# EAGLE schematic f28069M (EAGLE 7.7.0)
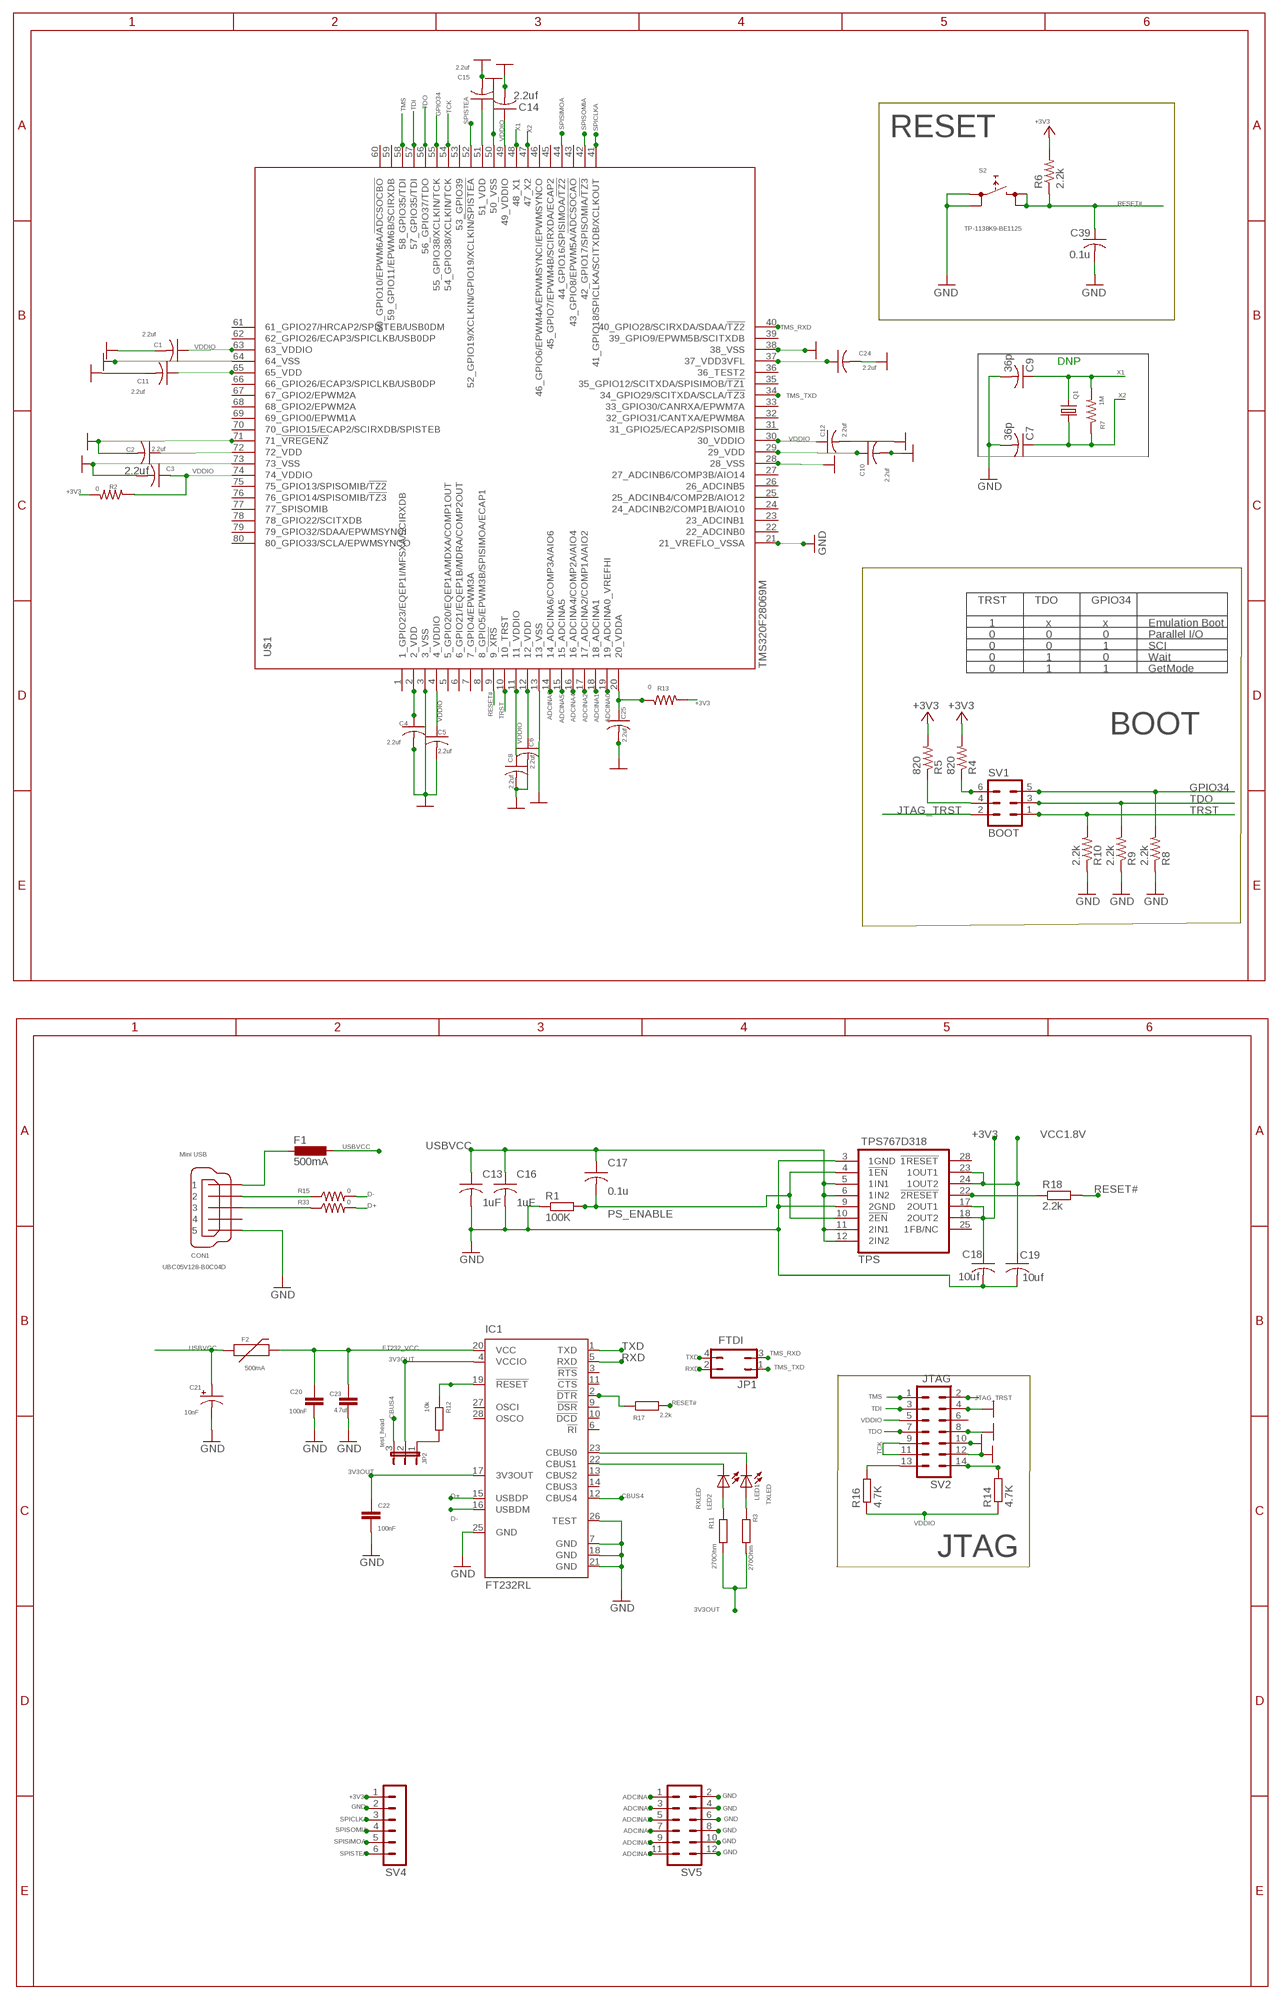
[diagram p0: schematic, sheet 1]

## Parts
C1  2.2uf  C-USC1206K  [C1206K]
C2  2.2uf  C-USC1206K  [C1206K]
C3  2.2uf  C-USC1206K  [C1206K]
C4  2.2uf  C-USC1206K  [C1206K]
C5  2.2uf  C-USC1206K  [C1206K]
C6  2.2uf  C-USC1206K  [C1206K]
C7  36p  C-USC1206K  [C1206K]
C8  2.2uf  C-USC1206K  [C1206K]
C9  36p  C-USC1206K  [C1206K]
C10  2.2uf  C-USC1206K  [C1206K]
C11  2.2uf  C-USC1206K  [C1206K]
C12  2.2uf  C-USC1206K  [C1206K]
C13  1uF  CAP-2,5  [C-2,5]
C14  2.2uf  C-USC1206K  [C1206K]
C15  2.2uf  C-USC1206K  [C1206K]
C16  1uF  CAP-2,5  [C-2,5]
C17  0.1u  CAP-2,5  [C-2,5]
C18  10uf  CAP-2,5  [C-2,5]
C19  10uf  CAP-2,5  [C-2,5]
C20  100nF  CAP1210  [1210]
C21  10nF  CAP_POL1206  [EIA3216]
C22  100nF  CAP1210  [1210]
C23  4.7uf  C2,5-3  [C2.5-3]
C24  2.2uf  C-USC1206K  [C1206K]
C25  2.2uf  C-USC1206K  [C1206K]
C39  0.1u  C-USC1206K  [C1206K]
CON1  UBC05V128-B0C04D  MINI-USB-32005-201  [32005-201]
F1  500mA  L-EUL1812  [L1812]
F2  500mA  PTCSMD  [PTC-1206]
IC1  FT232RL  [SSOP28]
JP1  FTDI  JP2Q  [JP2Q]
JP2  test_head  JP2E  [JP2]
LED1  TXLED  LEDCHIPLED_1206  [CHIPLED_1206]
LED2  RXLED  LEDCHIPLED_1206  [CHIPLED_1206]
Q1  CRYSTALHC49S  [HC49/S]
R1  100K  R-EU_M1206  [M1206]
R2  0  R-US_R1206  [R1206]
R3  270Ohm  R-EU_M1206  [M1206]
R4  820  R-US_R1206  [R1206]
R5  820  R-US_R1206  [R1206]
R6  2.2k  R-US_R1206  [R1206]
R7  1M  R-US_R1206  [R1206]
R8  2.2k  R-US_R1206  [R1206]
R9  2.2k  R-US_R1206  [R1206]
R10  2.2k  R-US_R1206  [R1206]
R11  270Ohm  R-EU_M1206  [M1206]
R12  10k  R-EU_M1206  [M1206]
R13  0  R-US_R1206  [R1206]
R14  4.7K  R-EU_M1206  [M1206]
R15  0  R-US_R1206  [R1206]
R16  4.7K  R-EU_M1206  [M1206]
R17  2.2k  R-EU_M1206  [M1206]
R18  2.2k  R-EU_M1206  [M1206]
R33  0  R-US_R1206W  [R1206W]
S2  TP-1138K9-BE1125  FSMJSMA  [FSMJSMA]
SV1  BOOT  MA03-2  [MA03-2]
SV2  JTAG  MA07-2  [MA07-2]
SV4  MA06-1  [MA06-1]
SV5  MA06-2  [MA06-2]
TPS  TPS767D318  767D3XX  [767D3XX]
U$1  TMS320F28069M  [S-PQFP-G80]

## Nets
3V3OUT: C22.1 IC1.4(VCCIO) IC1.17(3V3OUT) JP2.2 R3.2 R11.2
+3V3: C18.1 R2.2 R4.2 R5.2 R6.2 R13.2 SV4.1 TPS.17(2OUT1) TPS.18(2OUT2)
ADCINA0: SV5.1 U$1.19(19_ADCINA0_VREFHI)
ADCINA1: SV5.3 U$1.18(18_ADCINA1)
ADCINA2: SV5.5 U$1.17(17_ADCINA2/COMP1A/AIO2)
ADCINA4: SV5.7 U$1.16(16_ADCINA4/COMP2A/AIO4)
ADCINA5: SV5.9 U$1.15(15_ADCINA5)
ADCINA6: SV5.11 U$1.14(14_ADCINA6/COMP3A/AIO6)
CBUS4: IC1.12(CBUS4) JP2.3
D+: IC1.15(USBDP) R33.2
D-: IC1.16(USBDM) R15.2
FT232_VCC [power]: C20.1 C23.1 F2.2 IC1.20(VCC)
GND: C1.2 C2.2 C3.2 C4.2 C5.2 C6.2 C7.2 C8.2 C9.2 C10.2 C11.2 C12.2 C13.2 C14.2 C15.2 C16.2 C18.2 C19.2 C20.2 C21.C(-) C22.2 C23.2 C24.2 C25.2 C39.2 CON1.5 IC1.7(GND) IC1.18(GND) IC1.21(GND) IC1.25(GND) IC1.26(TEST) R1.1 R8.1 R9.1 R10.1 S2.P$1 S2.P$2 SV2.4 SV2.8 SV2.10 SV2.12 SV4.2 SV5.2 SV5.4 SV5.6 SV5.8 SV5.10 SV5.12 TPS.3(1GND) TPS.9(2GND) U$1.3(3_VSS) U$1.13(13_VSS) U$1.21(21_VREFLO_VSSA) U$1.28(28_VSS) U$1.38(38_VSS) U$1.50(50_VSS) U$1.64(64_VSS) U$1.71(71_!VREGENZ) U$1.73(73_VSS)
GPIO34: R8.2 SV1.5 U$1.55(55_GPIO38/XCLKIN/TCK)
JTAG_TRST: SV1.2 SV2.2
N$1: C10.1 U$1.29(29_VDD)
N$2: R16.2 SV2.13
N$3: C15.1 U$1.51(51_VDD)
N$4: C24.1 U$1.37(37_VDD3VFL)
N$5: R4.1 SV1.6
N$6: R5.1 SV1.4
N$7: R14.2 SV2.14
N$8: C11.1 U$1.65(65_VDD)
N$9: IC1.2(!DTR) R17.1
N$10: R18.1 TPS.22(!2RESET)
N$11: C2.1 U$1.72(72_VDD)
N$13: C4.1 U$1.2(2_VDD)
N$15: C6.1 U$1.12(12_VDD)
N$18: LED1.A R3.1
N$19: LED2.A R11.1
N$20: IC1.23(CBUS0) LED1.C
N$21: IC1.22(CBUS1) LED2.C
N$22: JP2.1 R12.2
N$38: CON1.2 R15.1
N$39: CON1.3 R33.1
PS_ENABLE: C17.2 R1.2 TPS.4(!1EN) TPS.10(!2EN)
RESET: IC1.19(!RESET) R12.1
RESET#: C39.1 R6.1 R17.2 R18.2 S2.P$3 S2.P$4 U$1.9(9_!XRS)
RXD: IC1.5(RXD) JP1.2
SPICLKA: SV4.3 U$1.41(41_GPIO18/SPICLKA/SCITXDB/XCLKOUT)
SPISIMOA: SV4.5 U$1.44(44_GPIO16/SPISIMOA/!TZ2)
SPISOMIA: SV4.4 U$1.42(42_GPIO17/SPISOMIA/!TZ3)
SPISTEA: SV4.6 U$1.52(52_GPIO19/XCLKIN/GPIO19/XCLKIN/!SPISTEA)
TCK: SV2.9 SV2.11 U$1.54(54_GPIO38/XCLKIN/TCK)
TDI: SV2.3 U$1.57(57_GPIO35/TDI)
TDO: R9.2 SV1.3 SV2.7 U$1.56(56_GPIO37/TDO)
TMS: SV2.1 U$1.58(58_GPIO35/TDI)
TMS_RXD: JP1.3 U$1.40(40_GPIO28/SCIRXDA/SDAA/!TZ2)
TMS_TXD: JP1.1 U$1.34(34_GPIO29/SCITXDA/SCLA/!TZ3)
TRST: R10.2 SV1.1 U$1.10(10_TRST)
TXD: IC1.1(TXD) JP1.4
USBVCC: C13.1 C16.1 C17.1 C21.A(+) F1.1 F2.1 TPS.5(1IN1) TPS.6(1IN2) TPS.11(2IN1) TPS.12(2IN2)
VCC1.8V: C19.1 TPS.23(1OUT1) TPS.24(1OUT2)
VDDA: C25.1 R13.1 U$1.20(20_VDDA)
VDDIO: C1.1 C3.1 C5.1 C8.1 C12.1 C14.1 R2.1 R14.1 R16.1 SV2.5 U$1.4(4_VDDIO) U$1.11(11_VDDIO) U$1.30(30_VDDIO) U$1.49(49_VDDIO) U$1.63(63_VDDIO) U$1.74(74_VDDIO)
X1: C9.1 Q1.2 R7.2 U$1.48(48_X1)
X2: C7.1 Q1.1 R7.1 U$1.47(47_X2)
XUSB: CON1.1 F1.2
Unconnected: CON1.4 IC1.3(!RTS) IC1.6(!RI) IC1.9(!DSR) IC1.10(!DCD) IC1.11(!CTS) IC1.13(CBUS2) IC1.14(CBUS3) IC1.27(OSCI) IC1.28(OSCO) SV2.6 TPS.25(1FB/NC) TPS.28(!1RESET) U$1.1(1_GPIO23/EQEP1I/MFSXA/SCIRXDB) U$1.5(5_GPIO20/EQEP1A/MDXA/COMP1OUT) U$1.6(6_GPIO21/EQEP1B/MDRA/COMP2OUT) U$1.7(7_GPIO4/EPWM3A) U$1.8(8_GPIO5/EPWM3B/SPISIMOA/ECAP1) U$1.22(22_ADCINB0) U$1.23(23_ADCINB1) U$1.24(24_ADCINB2/COMP1B/AIO10) U$1.25(25_ADCINB4/COMP2B/AIO12) U$1.26(26_ADCINB5) U$1.27(27_ADCINB6/COMP3B/AIO14) U$1.31(31_GPIO25/ECAP2/SPISOMIB) U$1.32(32_GPIO31/CANTXA/EPWM8A) U$1.33(33_GPIO30/CANRXA/EPWM7A) U$1.35(35_GPIO12/SCITXDA/SPISIMOB/!TZ1) U$1.36(36_TEST2) U$1.39(39_GPIO9/EPWM5B/SCITXDB) U$1.43(43_GPIO8/EPWM5A/!ADCSOCAO) U$1.45(45_GPIO7/EPWM4B/SCIRXDA/ECAP2) U$1.46(46_GPIO6/EPWM4A/EPWMSYNCI/EPWMSYNCO) U$1.53(53_GPIO39) U$1.59(59_GPIO11/EPWM6B/SCIRXDB) U$1.60(60_GPIO10/EPWM6A/!ADCSOCBO) U$1.61(61_GPIO27/HRCAP2/SPISTEB/USB0DM) U$1.62(62_GPIO26/ECAP3/SPICLKB/USB0DP) U$1.66(66_GPIO26/ECAP3/SPICLKB/USB0DP) U$1.67(67_GPIO2/EPWM2A) U$1.68(68_GPIO2/EPWM2A) U$1.69(69_GPIO0/EPWM1A) U$1.70(70_GPIO15/ECAP2/SCIRXDB/SPISTEB) U$1.75(75_GPIO13/SPISOMIB/!TZ2) U$1.76(76_GPIO14/SPISOMIB/!TZ3) U$1.77(77_SPISOMIB) U$1.78(78_GPIO22/SCITXDB) U$1.79(79_GPIO32/SDAA/EPWMSYNCI) U$1.80(80_GPIO33/SCLA/EPWMSYNCO)

## Notes on the sheet
- RESET
- DNP
- TRST | TDO | GPIO34
- 1 | x | x | Emulation Boot
- 0 | 0 | 0 | Parallel I/O
- 0 | 0 | 1 | SCI
- 0 | 1 | 0 | Wait
- 0 | 1 | 1 | GetMode
- BOOT
- Mini USB
- JTAG

## Library data of the parts
C1-C12 C14 C15 C24 C25 C39 = rcl:C-US: CAPACITOR, American symbol
C13 C16-C19 = DISCRETE:CAP-2,5
C20 C22 = SparkFun:CAP: Capacitor Standard 0603 ceramic capacitor, and 0.1" leaded capacitor.
C21 = SparkFun:CAP_POL: Capacitor Polarized These are standard SMD and PTH capacitors. Normally 10uF, 47uF, and 100uF in electrolytic and tantalum varieties. Always verify the external diameter of the through hole cap, it varies with capacity, voltage, and manufacturer. The EIA devices should be standard.
C23 = capacitor-wima:C: CAPACITOR naming: grid - package width
CON1 = con-cypressindustries:MINI-USB-: MINI USB-B Conector Source: www.cypressindustries.com; OC_FARNELL: unknown; OC_NEWARK: unknown
F1 = rcl:L-EU: INDUCTOR, European symbol
F2 = SparkFun:PTC: Resettable Fuse PTC Resettable Fuse. Spark Fun Electronics SKU : COM-08357
IC1 = ftdichip:FT232R: Source: http://www.ftdichip.com/Documents/DataSheets/DS_FT232R_v104.pdf; MPN: FT232RL; OC_FARNELL: 1146032; OC_NEWARK: 91K9918
JP1 = jumper:JP2Q: JUMPER
JP2 = jumper:JP2E: JUMPER
LED1 LED2 = led:LED: LED OSRAM: - CHIPLED LG R971, LG N971, LY N971, LG Q971, LY Q971, LO R971, LY R971 LH N974, LH R974 LS Q976, LO Q976, LY Q976 LO Q996 - Hyper CHIPLED LW Q18S LB Q993, LB Q99A, LB R99A - SideLED LS A670, LO A670, LY A670, LG A670, LP A670 LB A673, LV A673, LT A673, LW A673 LH A674 LY A675 LS A676, LA A676, LO A676, LY A676, LW A676 LS A679, LY A679, LG A679 - Hyper Micro SIDELED® LS Y876, LA Y876, LO Y876, LY Y876 LT Y87S - SmartLED LW L88C, LW L88S LB L89C, LB L89S, LG L890 LS L89K, LO L89K, LY L89K LS L896, LA L896, LO L896, LY L896 - TOPLED LS T670, LO T670, LY T670, LG T670, LP T670 LSG T670, LSP T670, LSY T670, LOP T670, LYG T670 LG T671, LOG T671, LSG T671 LB T673, LV T673, LT T673, LW T673 LH T674 LS T676, LA T676, LO T676, LY T676, LB T676, LH T676, LSB T676, LW T676 LB T67C, LV T67C, LT T67C, LS T67K, LO T67K, LY T67K, LW E67C LS E67B, LA E67B, LO E67B, LY E67B, LB E67C, LV E67C, LT E67C LW T67C LS T679, LY T679, LG T679 LS T770, LO T770, LY T770, LG T770, LP T770 LB T773, LV T773, LT T773, LW T773 LH T774 LS E675, LA E675, LY E675, LS T675 LS T776, LA T776, LO T776, LY T776, LB T776 LHGB T686 LT T68C, LB T68C - Hyper Mini TOPLED® LB M676 - Mini TOPLED Santana® LG M470 LS M47K, LO M47K, LY M47K Source: http://www.osram.convergy.de LUXEON: - LUMILED® LXK2-PW12-R00, LXK2-PW12-S00, LXK2-PW14-U00, LXK2-PW14-V00 LXK2-PM12-R00, LXK2-PM12-S00, LXK2-PM14-U00 LXK2-PE12-Q00, LXK2-PE12-R00, LXK2-PE12-S00, LXK2-PE14-T00, LXK2-PE14-U00 LXK2-PB12-K00, LXK2-PB12-L00, LXK2-PB12-M00, LXK2-PB14-N00, LXK2-PB14-P00, LXK2-PB14-Q00 LXK2-PR12-L00, LXK2-PR12-M00, LXK2-PR14-Q00, LXK2-PR14-R00 LXK2-PD12-Q00, LXK2-PD12-R00, LXK2-PD12-S00 LXK2-PH12-R00, LXK2-PH12-S00 LXK2-PL12-P00, LXK2-PL12-Q00, LXK2-PL12-R00 Source: www.luxeon.com KINGBRIGHT: KA-3528ASYC Source: www.kingbright.com
Q1 = crystal:CRYSTAL: CRYSTAL; OC_FARNELL: 1667008; OC_NEWARK: unknown
R1 R3 R11 R12 R14 R16-R18 = rcl:R-EU_: RESISTOR, European symbol
R2 R4-R10 R13 R15 R33 = rcl:R-US_: RESISTOR, American symbol
S2 = switch:FSMJSMA
SV1 = con-lstb:MA03-2: PIN HEADER; OC_FARNELL: unknown; OC_NEWARK: unknown
SV2 = con-lstb:MA07-2: PIN HEADER; OC_FARNELL: unknown; OC_NEWARK: unknown
SV4 = con-lstb:MA06-1: PIN HEADER; OC_FARNELL: unknown; OC_NEWARK: unknown
SV5 = con-lstb:MA06-2: PIN HEADER; OC_FARNELL: unknown; OC_NEWARK: unknown
TPS = C3X:767D3XX
U$1 = tms320f28069_board:TMS320F28069M

## Net classes
0 default: width 0.203 mm
1 power: width 0.254 mm